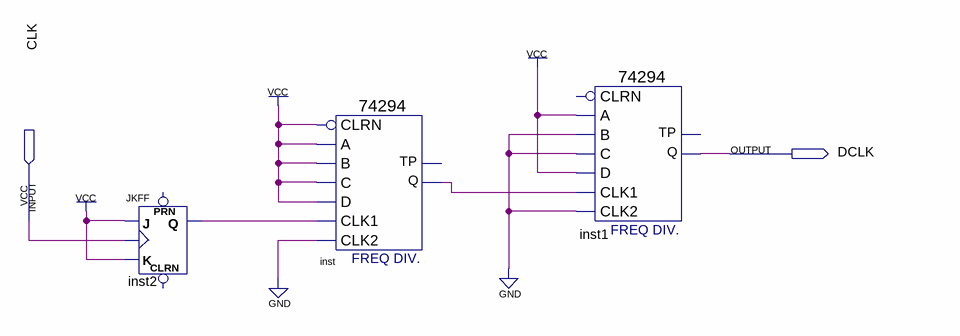
[diagram p0: schematic sheet]
// Quartus schematic rotiwero5.bdf as structural Verilog: 3 symbols, 2 pins
module rotiwero5 (
  input  CLK,
  output DCLK
);

  wire inst2_q, inst_q;

  JKFF inst2 (.K(1'b1), .J(1'b1), .CLK(CLK), .Q(inst2_q));  // open: PRN, CLRN
  \74294  inst (
    .A(1'b1), .B(1'b1), .C(1'b1), .CLK1(inst2_q), .CLK2(1'b0), .CLRN(1'b1), .D(1'b1), .Q(inst_q));  // open: TP
  \74294  inst1 (.A(1'b1), .B(1'b0), .C(1'b0), .CLK1(inst_q), .CLK2(1'b0), .D(1'b1), .Q(DCLK));  // open: CLRN, TP
endmodule
